# Altium schematic sheet HOBO.SchDoc
size B; SheetNumber: 1; SheetTotal: 1
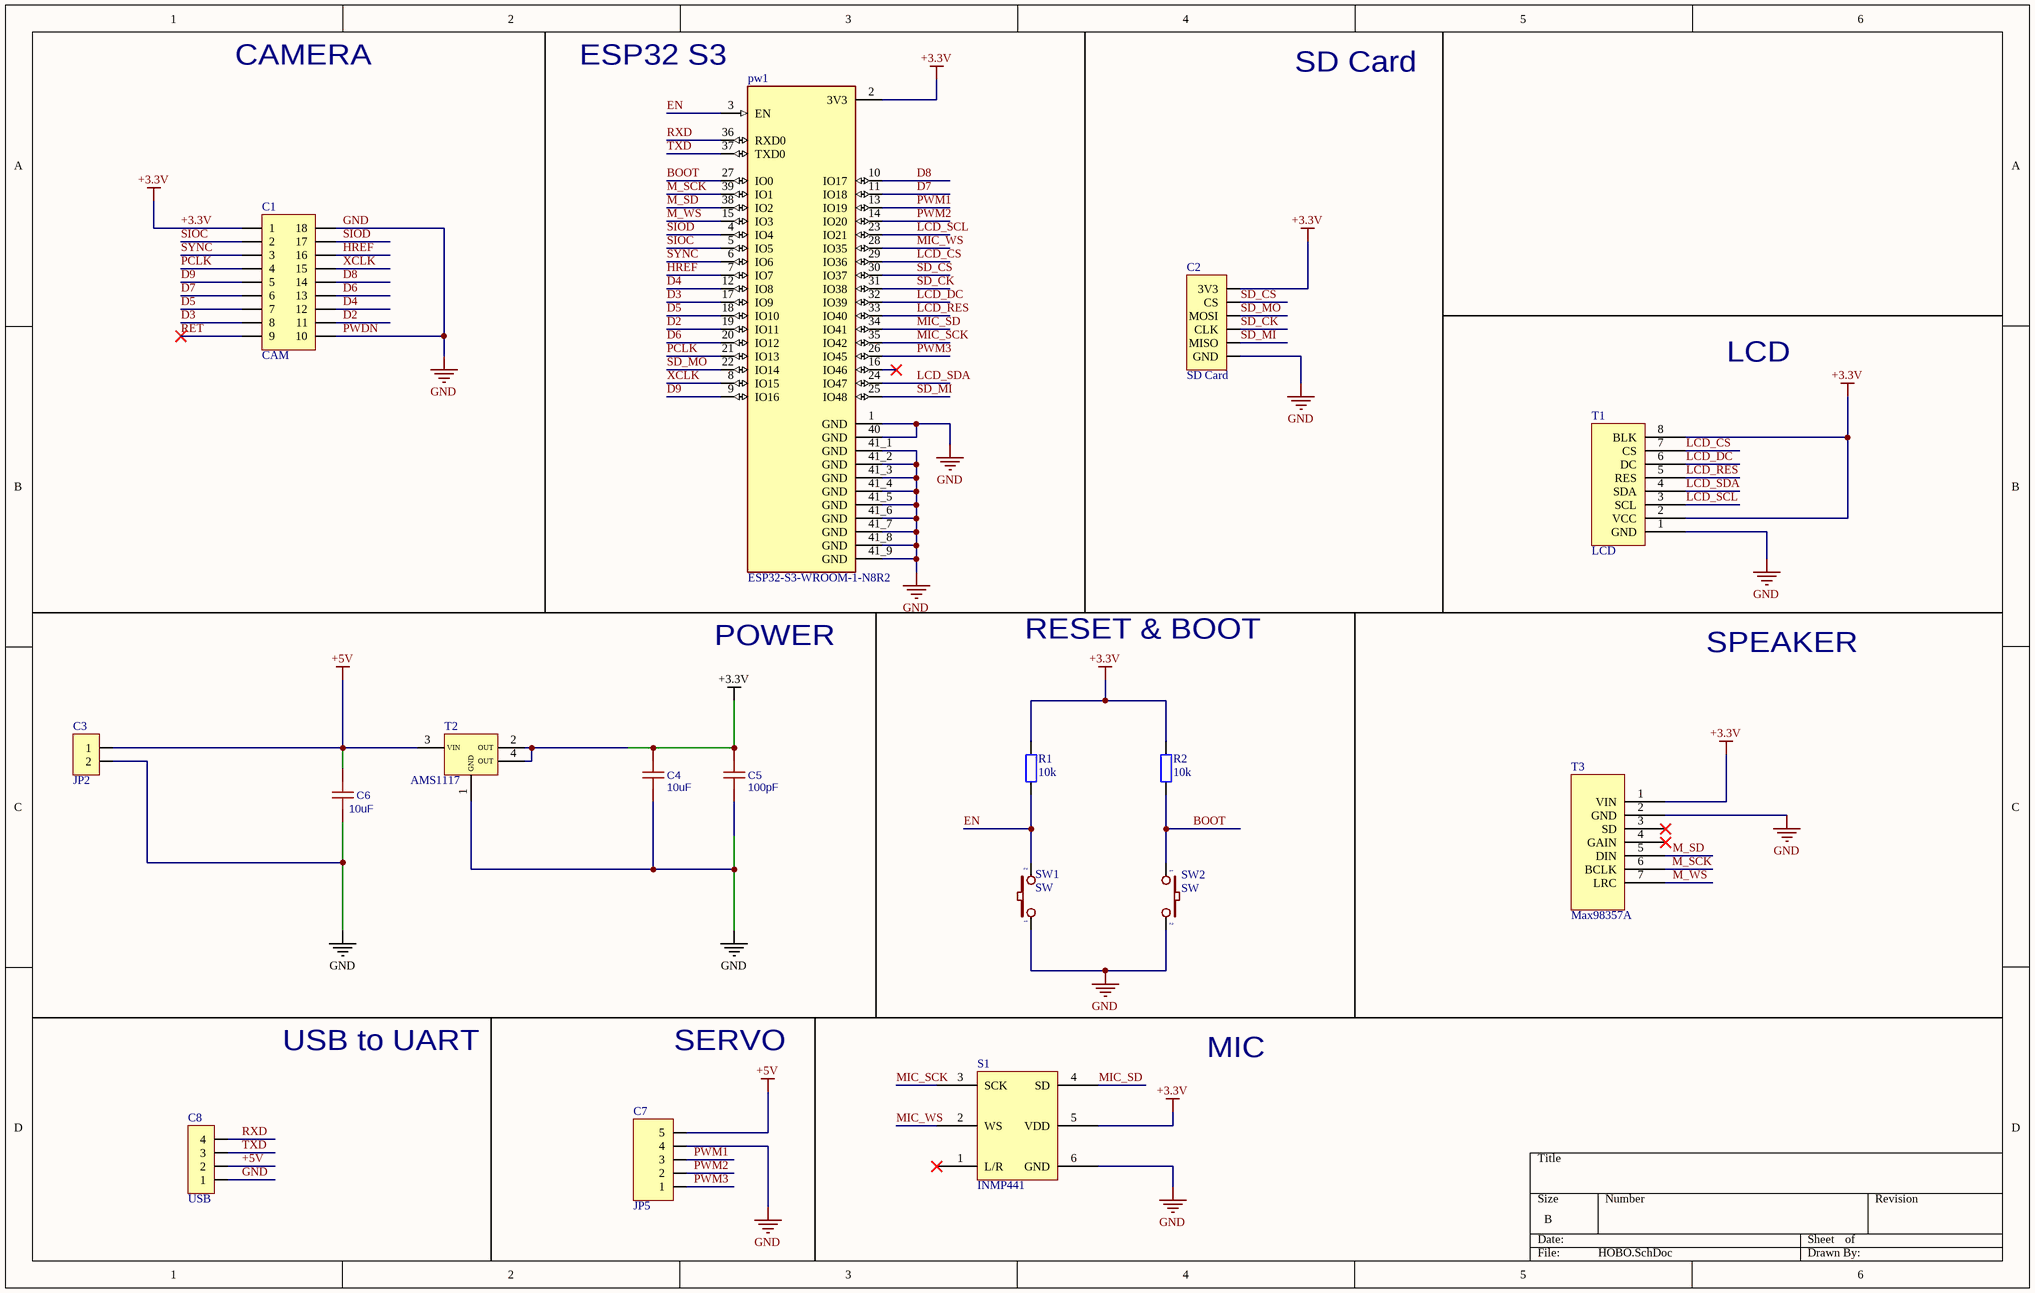
[diagram p0: HOBO.SchDoc]

## Parts
C1  CAM  [JP9-D2T]
C2  SD Card  [JP6-D1T]
C3  JP2  [JP2-D1C]
C4  10uF  [C0805]
C5  100pF  [C0805]
C6  10uF  [C0805]
C7  JP5  [JP5-D1C]
C8  USB  [JP4-C1T]
pw1  ESP32-S3-WROOM-1-N8R2  [XCVR_ESP32-S3-WROOM-1-N8R2]
R1  10k  [tro smd 0805]
R2  10k  [tro smd 0805]
S1  INMP441  [INMP441]
SW1  SW  [SW1-SMD]
SW2  SW  [SW1-SMD]
T1  LCD  [LCD jack]
T2  AMS1117  [AMS1117]
T3  Max98357A  [JackMax]

## Nets
+3.3V: C1.1 C2.6(3V3) C4.2 C5.2 pw1.2(3V3) R1.2 R2.2 S1.5(VDD) T1.2(VCC) T1.8(BLK) T2.2(OUT) T2.4(OUT) T3.1(VIN)
+5V: C3.1 C6.2 C7.5 C8.2 T2.3(VIN)
GND: C1.10 C1.18 C2.1(GND) C3.2 C4.1 C5.1 C6.1 C7.4 C8.1 pw1.1(GND) pw1.40(GND) pw1.41_1(GND) pw1.41_2(GND) pw1.41_3(GND) pw1.41_4(GND) pw1.41_5(GND) pw1.41_6(GND) pw1.41_7(GND) pw1.41_8(GND) pw1.41_9(GND) S1.6(GND) SW1.1 SW2.2 T1.1(GND) T2.1(GND) T3.2(GND)  [also labelled PWDN]
BOOT: pw1.27(IO0) R2.1 SW2.1
D2: C1.11 pw1.19(IO11)
D3: C1.8 pw1.17(IO9)
D4: C1.12 pw1.12(IO8)
D5: C1.7 pw1.18(IO10)
D6: C1.13 pw1.20(IO12)
D7: C1.6 pw1.11(IO18)
D8: C1.14 pw1.10(IO17)
D9: C1.5 pw1.9(IO16)
EN: pw1.3(EN) R1.1 SW1.2
HREF: C1.16 pw1.7(IO7)
LCD_CS: pw1.29(IO36) T1.7(CS)
LCD_DC: pw1.32(IO39) T1.6(DC)
LCD_RES: pw1.33(IO40) T1.5(RES)
LCD_SCL: pw1.23(IO21) T1.3(SCL)
LCD_SDA: pw1.24(IO47) T1.4(SDA)
M_SCK: pw1.39(IO1) T3.6(BCLK)
M_SD: pw1.38(IO2) T3.5(DIN)
M_WS: pw1.15(IO3) T3.7(LRC)
MIC_SCK: pw1.35(IO42) S1.3(SCK)
MIC_SD: pw1.34(IO41) S1.4(SD)
MIC_WS: pw1.28(IO35) S1.2(WS)
PCLK: C1.4 pw1.21(IO13)
PWM1: C7.3 pw1.13(IO19)
PWM2: C7.2 pw1.14(IO20)
PWM3: C7.1 pw1.26(IO45)
RET: C1.9
RXD: C8.4 pw1.36(RXD0)
SD_CK: C2.3(CLK) pw1.31(IO38)
SD_CS: C2.5(CS) pw1.30(IO37)
SD_MI: C2.2(MISO) pw1.25(IO48)
SD_MO: C2.4(MOSI) pw1.22(IO14)
SIOC: C1.2 pw1.5(IO5)
SIOD: C1.17 pw1.4(IO4)
SYNC: C1.3 pw1.6(IO6)
TXD: C8.3 pw1.37(TXD0)
XCLK: C1.15 pw1.8(IO15)

Not connected (* = marked no-connect by the designer): pw1 16(IO46)*; S1 1(L/R)*; T3 3(SD)* 4(GAIN)*

## Notes on the sheet
- CAMERA
- ESP32 S3
- SD Card
- LCD
- RESET & BOOT
- POWER
- SPEAKER
- USB to UART
- SERVO
- MIC

## Library data of the parts
C1 = JP9x2: WR-PHD 2.54 mm Dual Socket Header; Manufacturer: W¨¹rth Elektronik eiSos GmbH; partNo: 61301821821; ComponentLink1 Description: Manufacturer; ComponentLink2 Description: Datasheet; NoPins: 18; Created Date: 29 March 2013; ComponentLink1URL: http://www.we-online.com; ComponentLink2URL: http://katalog.we-online.de/em/datasheet/6130xx21821.pdf; Created by: Karrer Zheng
C2 = JP6: WR-PHD 2.54 mm Angled Socket Header; Manufacturer: W¨¹rth Elektronik eiSos GmbH; partNo: 613006143121; ComponentLink1 Description: Manufacturer; ComponentLink2 Description: Datasheet; NoPins: 06; Created Date: 29 March 2013; ComponentLink1URL: http://www.we-online.com; ComponentLink2URL: http://katalog.we-online.de/em/datasheet/6130xx143121.pdf; Created by: Karrer Zheng
C3 = JP2: WR-PHD 2.54 mm Angled Socket Header; Manufacturer: W¨¹rth Elektronik eiSos GmbH; partNo: 613002143121; ComponentLink1 Description: Manufacturer; ComponentLink2 Description: Datasheet; NoPins: 02; Created Date: 29 March 2013; ComponentLink1URL: http://www.we-online.com; ComponentLink2URL: http://katalog.we-online.de/em/datasheet/6130xx143121.pdf; Created by: Karrer Zheng
C4-C6 = 10uF: Manufacturer: FH; Manufacturer Part: 0805F106M160NT; nameAlias: Capacitance; SMT Type: Extend; Supplier: LCSC; Supplier Part: C90545; JLCPCB SMD: Yes; spicePre: C; spiceSymbolName: 0805F106M160NT
C7 = JP5: WR-PHD 2.54 mm Angled Socket Header; Manufacturer: W¨¹rth Elektronik eiSos GmbH; partNo: 613005143121; ComponentLink1 Description: Manufacturer; ComponentLink2 Description: Datasheet; NoPins: 05; Created Date: 29 March 2013; ComponentLink1URL: http://www.we-online.com; ComponentLink2URL: http://katalog.we-online.de/em/datasheet/6130xx143121.pdf; Created by: Karrer Zheng
C8 = JP4: WR-PHD 2.54 mm Angled Socket Header; Manufacturer: W¨¹rth Elektronik eiSos GmbH; partNo: 613004143121; ComponentLink1 Description: Manufacturer; ComponentLink2 Description: Datasheet; NoPins: 04; Created Date: 29 March 2013; ComponentLink1URL: http://www.we-online.com; ComponentLink2URL: http://katalog.we-online.de/em/datasheet/6130xx143121.pdf; Created by: Karrer Zheng
pw1 = ESP32-S3-WROOM-1-N8R2: MF: {'manufacturer': u'Espressif Systems'}; Package: None; Price: None; Value: *; MP: ESP32-S3-WROOM-1-N8R2; Availability: Unavailable
R1 R2 = Tro 0805 1% 10k: Dán; Don_Vi: Con; So_Chan: 2; Ten_Linh_Kien: Trở 0805 1% 10k; Ma_Hang: MH005473; Chung_Loai: Dán; Kieu_Chan: *
SW1 SW2 = SW2: Switch button 2 pin; Value: SW chip 2 pin